# Altium schematic sheet 91.Debug UART_JTAG.SchDoc
size 420 x 297 mm; Revision: V2.1; Schematic Page Number: 11; Page Number: 38; Check: Default; Schematic Name: RK_NVR_DEMO1_RK3588_LP4/4x_V21; Page Count: 43; Page name: 91.Debug UART/JTAG; Designer: Zhangdz; Schematic Page Count: 99; Revcode: V2.1; DsnPath: E:\Work\SBER\RK3588_SOM\temp\RK_NVR_DEMO1_RK3588_LP4XD200P232SD8_V21_20211228.DSN; SchematicName: RK_NVR_DEMO1_RK3588_LP4/4x_V21; PageName: 91.Debug UART/JTAG; PageSize: A3; TopSchematic: True
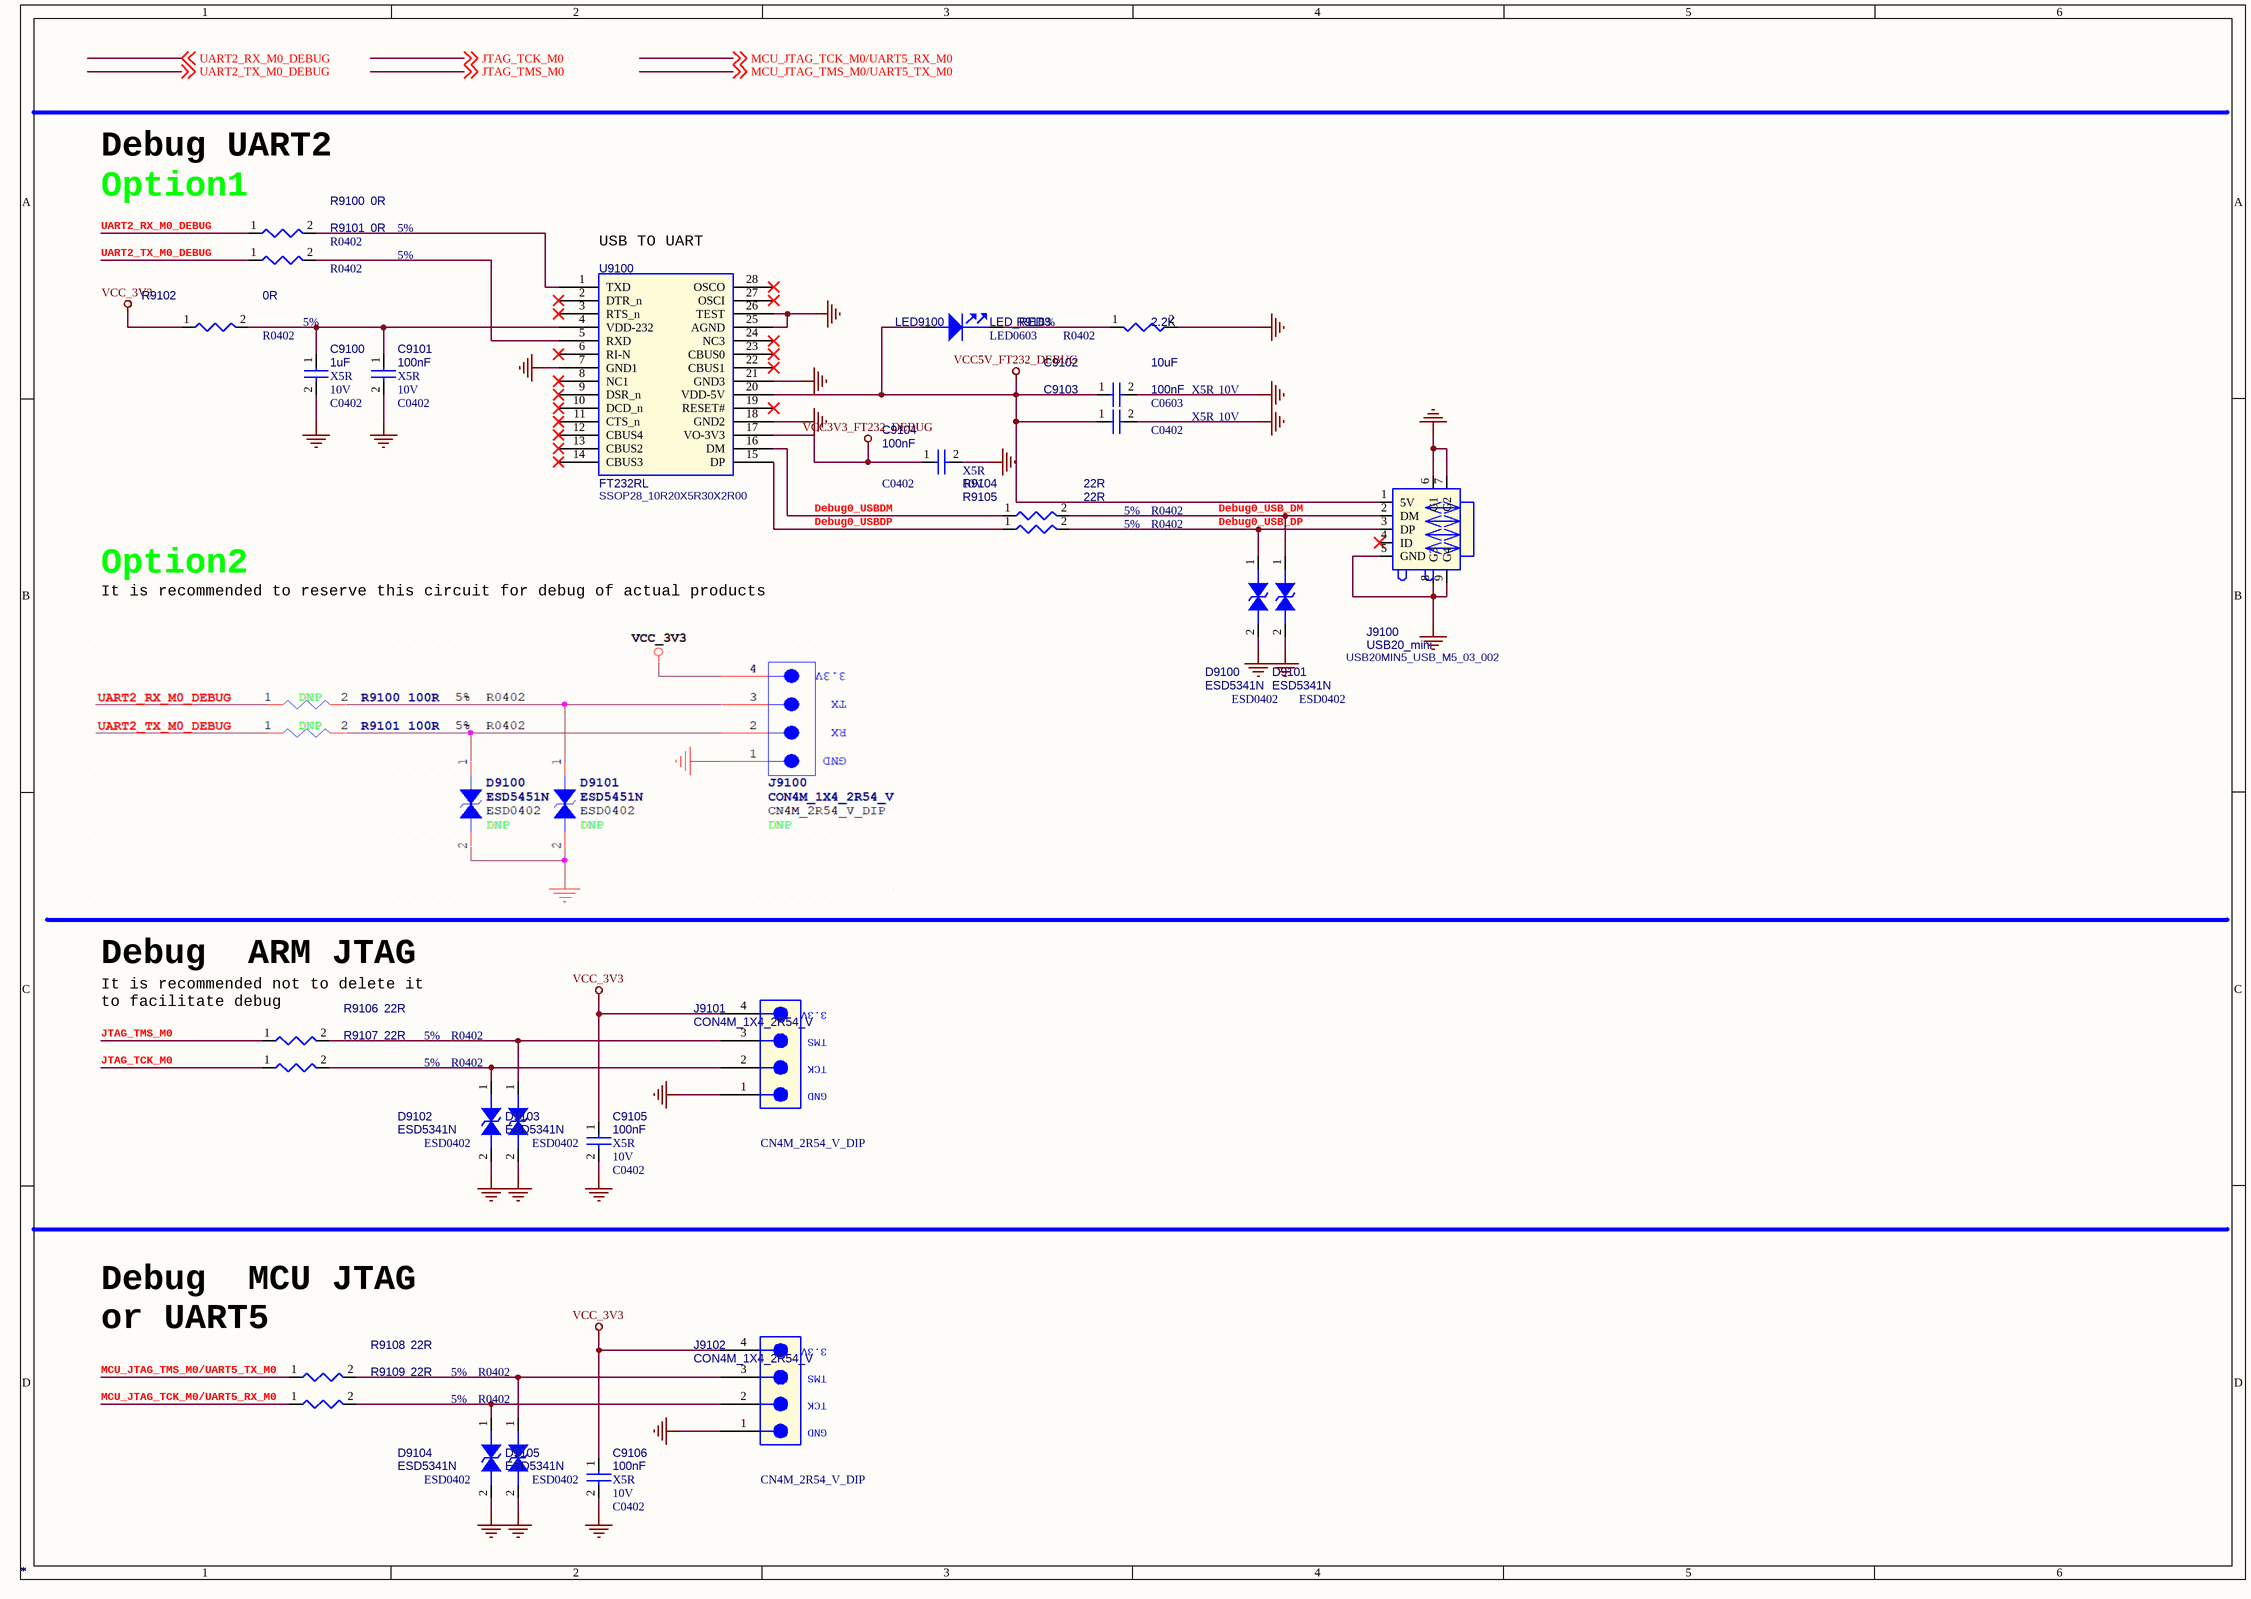
[diagram p0: 91.Debug UART_JTAG.SchDoc]

## Parts
C9100  *  Voltage: 10V  Dielectric: X5R  [C0402]
C9101  *  Voltage: 10V  Dielectric: X5R  [C0402]
C9102  *  Voltage: 10V  Dielectric: X5R  [C0603]
C9103  *  Voltage: 10V  Dielectric: X5R  [C0402]
C9104  *  Voltage: 10V  Dielectric: X5R  [C0402]
C9105  *  Voltage: 10V  Dielectric: X5R  [C0402]
C9106  *  Voltage: 10V  Dielectric: X5R  [C0402]
D9100  *  [ESD0402]
D9101  *  [ESD0402]
D9102  *  [ESD0402]
D9103  *  [ESD0402]
D9104  *  [ESD0402]
D9105  *  [ESD0402]
J9100  *  [USB20MIN5_USB_M5_03_002]
J9101  *  [CN4M_2R54_V_DIP]
J9102  *  [CN4M_2R54_V_DIP]
LED9100  *  [LED0603]
R9100  *  Tolerance: 5%  [R0402]
R9101  *  Tolerance: 5%  [R0402]
R9102  *  Tolerance: 5%  [R0402]
R9103  *  Tolerance: 5%  [R0402]
R9104  *  Tolerance: 5%  [R0402]
R9105  *  Tolerance: 5%  [R0402]
R9106  *  Tolerance: 5%  [R0402]
R9107  *  Tolerance: 5%  [R0402]
R9108  *  Tolerance: 5%  [R0402]
R9109  *  Tolerance: 5%  [R0402]
U9100  *  PCB Footprint: SSOP28_10R20X5R30X2R00  [SSOP28]

## Nets
GND: C9100.2 C9101.2 C9102.2 C9103.2 C9104.2 C9105.2 C9106.2 D9100.2 D9101.2 D9102.2 D9103.2 D9104.2 D9105.2 J9100.5(GND) J9100.6(G1) J9100.7(G2) J9100.8(G3) J9100.9(G4) J9101.1 J9102.1 R9103.2 U9100.7(GND1) U9100.18(GND2) U9100.21(GND3) U9100.25(AGND) U9100.26(TEST)
VCC3V3_FT232_DEBUG: C9104.1 U9100.17(VO-3V3)
VCC5V_FT232_DEBUG: C9102.1 C9103.1 J9100.1(5V) LED9100.1(ANODE) U9100.20(VDD-5V)
VCC_3V3: C9105.1 C9106.1 J9101.4 J9102.4 R9102.1
Debug0_USB_DM: D9101.1 J9100.2(DM) R9104.2
Debug0_USB_DP: D9100.1 J9100.3(DP) R9105.2
Debug0_USBDM: R9104.1 U9100.16(DM)
Debug0_USBDP: R9105.1 U9100.15(DP)
JTAG_TCK_M0: R9107.1 ; off-sheet JTAG_TCK_M0
JTAG_TMS_M0: R9106.1 ; off-sheet JTAG_TMS_M0
MCU_JTAG_TCK_M0/UART5_RX_M0: R9109.1 ; off-sheet MCU_JTAG_TCK_M0/UART5_RX_M0
MCU_JTAG_TMS_M0/UART5_TX_M0: R9108.1 ; off-sheet MCU_JTAG_TMS_M0/UART5_TX_M0
UART2_RX_M0_DEBUG: R9100.1 ; off-sheet UART2_RX_M0_DEBUG
UART2_TX_M0_DEBUG: R9101.1 ; off-sheet UART2_TX_M0_DEBUG
NetC9100_1: C9100.1 C9101.1 R9102.2 U9100.4(VDD-232)
NetD9102_1: D9102.1 J9101.2(RX) R9107.2
NetD9103_1: D9103.1 J9101.3 R9106.2
NetD9104_1: D9104.1 J9102.2(RX) R9109.2
NetD9105_1: D9105.1 J9102.3 R9108.2
NetLED9100_2: LED9100.2(CATHODE) R9103.1
NetR9100_2: R9100.2 U9100.1(TXD)
NetR9101_2: R9101.2 U9100.5(RXD)

Not connected (* = marked no-connect by the designer): J9100 4(ID)*; U9100 2(DTR_n)* 3(RTS_n)* 6(RI-N)* 8(NC1)* 9(DSR_n)* 10(DCD_n)* 11(CTS_n)* 12(CBUS4)* 13(CBUS2)* 14(CBUS3)* 19(RESET#)* 22(CBUS1)* 23(CBUS0)* 24(NC3)* 27(OSCI)* 28(OSCO)*

## Notes on the sheet
- Debug UART2
- Option1
- (near U9100) USB TO UART
- It is recommended to reserve this circuit for debug of actual products
- Option2
- Debug  ARM JTAG
- (near R9106) It is recommended not to delete it
  to facilitate debug
- (near R9108) Debug  MCU JTAG
  or UART5
- (in symbol HEADER 4_0) 3.3V; TMS; TCK; GND

## Library data of the parts
C9100 = CAP NP: cap,1.00uF,+/-10%,10V,X5R,C0402; Part Reference: C9100; Manufacturer PN: C1005X5R1A105K050BB; Manufacturer: TDK; Value: 1uF; Tolerance: 10%; C_Voltage: 6.3V; Priority: A; PCB Footprint: C0402; Created by: JJJ; Part Type: C0402; RK PN: C1005X5R1A105K050BB
C9101 = CAP NP: cap,100.00nF,+/-10%,10V,X5R,C0402; Part Reference: C9101; Manufacturer: TDK; Value: 100nF; RK PN: C1005X5R1A104K050BA; Priority: A; Tolerance: 10%; PCB Footprint: C0402; Part Type: C0402; Manufacturer PN: C1005X5R1A104K050BA; Created by: JJJ
C9102 = CAP NP: cap,10.00uF,+/-10%,10V,X5R,C0603; Part Reference: C9102; Manufacturer: TDK; Value: 10uF; RK PN: C1608X5R1A106K080AC; Priority: A; Tolerance: 10%; PCB Footprint: C0603; Part Type: C0603; Manufacturer PN: C1608X5R1A106K080AC; Created by: JJJ
C9103 = CAP NP: cap,100.00nF,+/-10%,10V,X5R,C0402; Part Reference: C9103; Manufacturer: TDK; Value: 100nF; RK PN: C1005X5R1A104K050BA; Priority: A; Tolerance: 10%; PCB Footprint: C0402; Part Type: C0402; Manufacturer PN: C1005X5R1A104K050BA; Created by: JJJ
C9104 = CAP NP: cap,100.00nF,+/-10%,10V,X5R,C0402; Part Reference: C9104; Manufacturer PN: C1005X5R1A104K050BA; Manufacturer: TDK; Value: 100nF; Tolerance: 10%; Priority: A; PCB Footprint: C0402; Created by: JJJ; Part Type: C0402; RK PN: C1005X5R1A104K050BA
C9105 = CAP NP: cap,100.00nF,+/-10%,10V,X5R,C0402; Part Reference: C9105; Manufacturer PN: C1005X5R1A104K050BA; Manufacturer: TDK; Value: 100nF; Tolerance: 10%; Priority: A; PCB Footprint: C0402; Created by: JJJ; Part Type: C0402; RK PN: C1005X5R1A104K050BA
C9106 = CAP NP: cap,100.00nF,+/-10%,10V,X5R,C0402; Part Reference: C9106; Manufacturer PN: C1005X5R1A104K050BA; Manufacturer: TDK; Value: 100nF; Tolerance: 10%; Priority: A; PCB Footprint: C0402; Created by: JJJ; Part Type: C0402; RK PN: C1005X5R1A104K050BA
D9100 = DIODE BI_DIR TRIG: 1-Line, Bi-directional, Transient Voltage Suppressors.1pF.; Part Reference: D9100; Manufacturer: WillSemi(О¤¶ы°лµјМе); Value: ESD5341N; Priority: A; PCB Footprint: ESD0402; Created by: JJJ; Manufacturer PN: ESD5341N; Part Type: ESD_TVS; RK PN: ESD5341N
D9101 = DIODE BI_DIR TRIG: 1-Line, Bi-directional, Transient Voltage Suppressors.1pF.; Part Reference: D9101; Manufacturer: WillSemi(О¤¶ы°лµјМе); Value: ESD5341N; Priority: A; PCB Footprint: ESD0402; RK PN: ESD5341N; Part Type: ESD_TVS; Manufacturer PN: ESD5341N; Created by: JJJ
D9102 = DIODE BI_DIR TRIG: 1-Line, Bi-directional, Transient Voltage Suppressors.1pF.; Part Reference: D9102; Manufacturer: WillSemi(О¤¶ы°лµјМе); Value: ESD5341N; Priority: A; PCB Footprint: ESD0402; Created by: JJJ; Manufacturer PN: ESD5341N; Part Type: ESD_TVS; RK PN: ESD5341N
D9103 = DIODE BI_DIR TRIG: 1-Line, Bi-directional, Transient Voltage Suppressors.1pF.; Part Reference: D9103; Manufacturer: WillSemi(О¤¶ы°лµјМе); Value: ESD5341N; Priority: A; PCB Footprint: ESD0402; RK PN: ESD5341N; Part Type: ESD_TVS; Manufacturer PN: ESD5341N; Created by: JJJ
D9104 = DIODE BI_DIR TRIG: 1-Line, Bi-directional, Transient Voltage Suppressors.1pF.; Part Reference: D9104; Manufacturer: WillSemi(О¤¶ы°лµјМе); Value: ESD5341N; Priority: A; PCB Footprint: ESD0402; RK PN: ESD5341N; Part Type: ESD_TVS; Manufacturer PN: ESD5341N; Created by: JJJ
D9105 = DIODE BI_DIR TRIG: 1-Line, Bi-directional, Transient Voltage Suppressors.1pF.; Part Reference: D9105; Manufacturer: WillSemi(О¤¶ы°лµјМе); Value: ESD5341N; Priority: A; PCB Footprint: ESD0402; Created by: JJJ; Manufacturer PN: ESD5341N; Part Type: ESD_TVS; RK PN: ESD5341N
J9100 = USB20_MINI: USB2.0 MiniРНОФКЅІаІеДёЧщЈ¬Мщєё; Part Reference: J9100; Manufacturer Part Number: USB-M5-03-002; Manufacturer: НъїЖґп; Priority: A; PCB Footprint: USB20MIN5_USB_M5_03_002; Value: USB20_mini; Created by: JJJ; Part Type: USB Jack; RK PN: USB-M5-03-002
J9101 = HEADER 4_0: Part Reference: J9101; Value: CON4M_1X4_2R54_V; PCB Footprint: CN4M_2R54_V_DIP
J9102 = HEADER 4_0: Part Reference: J9102; Value: CON4M_1X4_2R54_V; PCB Footprint: CN4M_2R54_V_DIP
LED9100 = LED: МщЖ¬LEDµЖЈ¬0603Ј¬ємЙ«; Part Reference: LED9100; Value: LED_RED; Priority: A; PCB Footprint: LED0603; Created by: JJJ; Part Type: LED; RK PN: LED_RED
R9100 = RESISTOR_Dup1: НЁУГєсД¤µзЧи,0R,+/-5%,R0402,1/16W.; Part Reference: R9100; Manufacturer PN: RC0402JR-070RL; Manufacturer: YAGEO; Wattage: 1/16W; Priority: A; PCB Footprint: R0402; Value: 0R; Created by: YTL; Part Type: НЁУГєсД¤µзЧи; RK PN: RC0402JR-070RL
R9101 = RESISTOR_Dup1: НЁУГєсД¤µзЧи,0R,+/-5%,R0402,1/16W.; Part Reference: R9101; Manufacturer: YAGEO; RK PN: RC0402JR-070RL; Priority: A; Wattage: 1/16W; PCB Footprint: R0402; Value: 0R; Part Type: НЁУГєсД¤µзЧи; Manufacturer PN: RC0402JR-070RL; Created by: YTL
R9102 = RESISTOR_Dup1: НЁУГєсД¤µзЧи,0R,+/-5%,R0402,1/16W.; Part Reference: R9102; Manufacturer: YAGEO; RK PN: RC0402JR-070RL; Priority: A; Wattage: 1/16W; PCB Footprint: R0402; Value: 0R; Part Type: НЁУГєсД¤µзЧи; Manufacturer PN: RC0402JR-070RL; Created by: YTL
R9103 = RESISTOR_Dup1: НЁУГєсД¤µзЧи,2K2,+/-5%,R0402,1/16W.; Part Reference: R9103; Manufacturer PN: RC0402JR-072K2L; Manufacturer: YAGEO; Value: 2.2K; Wattage: 1/16W; Priority: A; PCB Footprint: R0402; Created by: YTL; Part Type: НЁУГєсД¤µзЧи; RK PN: RC0402JR-072K2L
R9104 = RESISTOR_Dup1: НЁУГєсД¤µзЧи,22R,+/-5%,R0402,1/16W.; Part Reference: R9104; Manufacturer: YAGEO; RK PN: RC0402JR-0722RL; Priority: A; Wattage: 1/16W; PCB Footprint: R0402; Value: 22R; Part Type: НЁУГєсД¤µзЧи; Manufacturer PN: RC0402JR-0722RL; Created by: YTL
R9105 = RESISTOR_Dup1: НЁУГєсД¤µзЧи,22R,+/-5%,R0402,1/16W.; Part Reference: R9105; Manufacturer: YAGEO; RK PN: RC0402JR-0722RL; Priority: A; Wattage: 1/16W; PCB Footprint: R0402; Value: 22R; Part Type: НЁУГєсД¤µзЧи; Manufacturer PN: RC0402JR-0722RL; Created by: YTL
R9106 = RESISTOR_Dup1: НЁУГєсД¤µзЧи,22R,+/-5%,R0402,1/16W.; Part Reference: R9106; Manufacturer: YAGEO; RK PN: RC0402JR-0722RL; Priority: A; Wattage: 1/16W; PCB Footprint: R0402; Value: 22R; Part Type: НЁУГєсД¤µзЧи; Manufacturer PN: RC0402JR-0722RL; Created by: YTL
R9107 = RESISTOR_Dup1: НЁУГєсД¤µзЧи,22R,+/-5%,R0402,1/16W.; Part Reference: R9107; Manufacturer PN: RC0402JR-0722RL; Manufacturer: YAGEO; Wattage: 1/16W; Priority: A; PCB Footprint: R0402; Value: 22R; Created by: YTL; Part Type: НЁУГєсД¤µзЧи; RK PN: RC0402JR-0722RL
R9108 = RESISTOR_Dup1: НЁУГєсД¤µзЧи,22R,+/-5%,R0402,1/16W.; Part Reference: R9108; Manufacturer: YAGEO; RK PN: RC0402JR-0722RL; Priority: A; Wattage: 1/16W; PCB Footprint: R0402; Value: 22R; Part Type: НЁУГєсД¤µзЧи; Manufacturer PN: RC0402JR-0722RL; Created by: YTL
R9109 = RESISTOR_Dup1: НЁУГєсД¤µзЧи,22R,+/-5%,R0402,1/16W.; Part Reference: R9109; Manufacturer PN: RC0402JR-0722RL; Manufacturer: YAGEO; Wattage: 1/16W; Priority: A; PCB Footprint: R0402; Value: 22R; Created by: YTL; Part Type: НЁУГєсД¤µзЧи; RK PN: RC0402JR-0722RL
U9100 = Interface_FT232RL: Single chip USB to asynchronous serial data transfer interface.; Part Reference: U9100; Manufacturer: FTDI Chip; Priority: A; Value: FT232RL; RK PN: FT232RL; Part Type: Interface; Manufacturer PN: FT232RL; Created by: JJJ